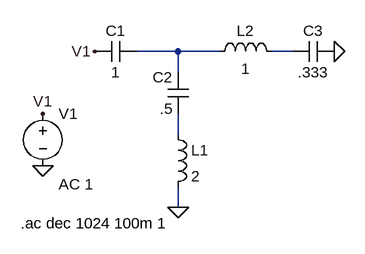
[diagram p0: schematic cuadripolo1.asc]
cuadripolo1.asc, the LTspice schematic file:
Version 4
SHEET 1 880 680
WIRE 144 112 80 112
WIRE 208 112 144 112
WIRE 320 112 288 112
WIRE 144 144 144 112
WIRE 144 240 144 208
WIRE 144 352 144 320
FLAG 144 352 0
FLAG -64 288 0
FLAG -64 208 V1
FLAG 384 112 0
FLAG 16 112 V1
SYMBOL cap 80 96 R90
WINDOW 0 0 32 VBottom 2
WINDOW 3 32 32 VTop 2
SYMATTR InstName C1
SYMATTR Value 1
SYMBOL cap 160 208 R180
WINDOW 0 24 56 Left 2
WINDOW 3 24 8 Left 2
SYMATTR InstName C2
SYMATTR Value .5
SYMBOL ind 128 224 R0
SYMATTR InstName L1
SYMATTR Value 2
SYMBOL ind 192 128 R270
WINDOW 0 32 56 VTop 2
WINDOW 3 5 56 VBottom 2
SYMATTR InstName L2
SYMATTR Value 1
SYMBOL cap 384 96 R90
WINDOW 0 0 32 VBottom 2
WINDOW 3 32 32 VTop 2
SYMATTR InstName C3
SYMATTR Value .333
SYMBOL voltage -64 192 R0
WINDOW 123 24 124 Left 2
WINDOW 39 0 0 Left 0
SYMATTR InstName V1
SYMATTR Value ""
SYMATTR Value2 AC 1
TEXT -98 376 Left 2 !.ac dec 1024 100m 1

The netlist it stands for:
* cuadripolo1.asc
C1 N001 V1 1
C2 N003 N001 .5
L1 N003 0 2
L2 N001 N002 1
C3 0 N002 .333
V1 V1 0 AC 1
.ac dec 1024 100m 1
.backanno
.end